# Altium schematic sheet Sensing.SchDoc
size A; SheetNumber: 2; SheetTotal: 2
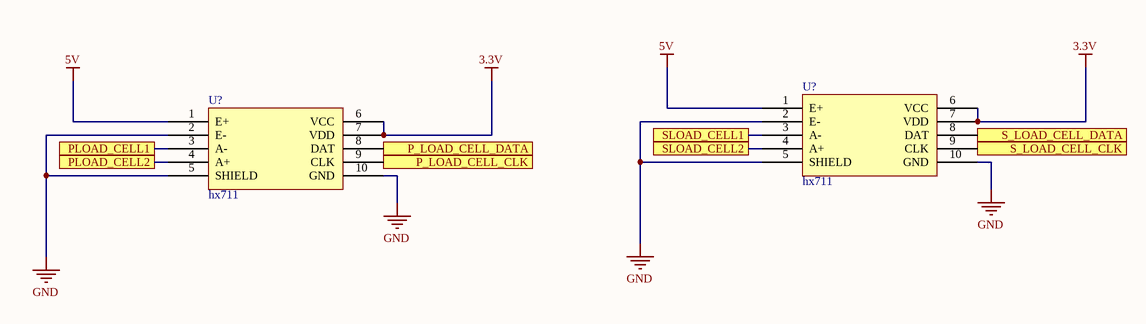
[diagram p0: Sensing.SchDoc]

## Parts
(Parts that share a designator on the sheet are numbered #1, #2 ... from top to bottom, then left to right.)
U?#1  hx711  [PCBComponent_1]
U?#2  hx711  [PCBComponent_1]

## Ports
P_LOAD_CELL_CLK, P_LOAD_CELL_DATA, PLOAD_CELL1, PLOAD_CELL2, S_LOAD_CELL_CLK, S_LOAD_CELL_DATA, SLOAD_CELL1, SLOAD_CELL2

## Nets
3.3V: U?#1.6(VCC) U?#1.7(VDD) U?#2.6(VCC) U?#2.7(VDD)
5V: U?#1.1(E+) U?#2.1(E+)
GND: U?#1.2(E-) U?#1.5(SHIELD) U?#1.10(GND) U?#2.2(E-) U?#2.5(SHIELD) U?#2.10(GND)
P_LOAD_CELL_CLK: U?#2.9(CLK) ; port P_LOAD_CELL_CLK
P_LOAD_CELL_DATA: U?#2.8(DAT) ; port P_LOAD_CELL_DATA
PLOAD_CELL1: U?#2.3(A-) ; port PLOAD_CELL1
PLOAD_CELL2: U?#2.4(A+) ; port PLOAD_CELL2
S_LOAD_CELL_CLK: U?#1.9(CLK) ; port S_LOAD_CELL_CLK
S_LOAD_CELL_DATA: U?#1.8(DAT) ; port S_LOAD_CELL_DATA
SLOAD_CELL1: U?#1.3(A-) ; port SLOAD_CELL1
SLOAD_CELL2: U?#1.4(A+) ; port SLOAD_CELL2

## Library data of the parts
U?#1 U?#2 = Component_1